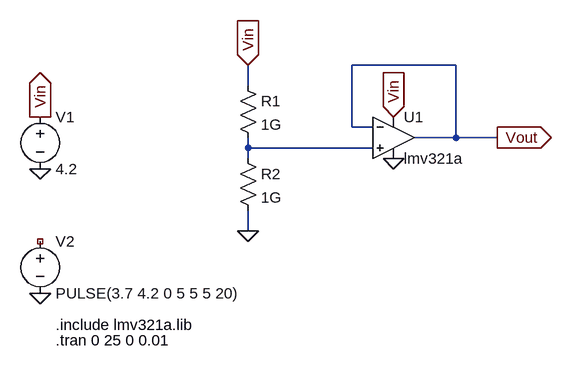
[diagram p0: schematic EEE3088F_ADC_buffer_test.asc]
EEE3088F_ADC_buffer_test.asc, the LTspice schematic file:
Version 4
SHEET 1 880 680
WIRE 496 32 336 32
WIRE 176 64 176 32
WIRE 336 128 336 32
WIRE 368 128 336 128
WIRE 496 144 496 32
WIRE 496 144 432 144
WIRE 560 144 496 144
WIRE 176 160 176 144
WIRE 368 160 176 160
WIRE 176 176 176 160
WIRE 176 288 176 256
FLAG -144 192 0
FLAG 400 176 0
FLAG -144 112 Vin
IOPIN -144 112 Out
FLAG -144 384 0
FLAG 176 32 Vin
IOPIN 176 32 In
FLAG 560 144 Vout
IOPIN 560 144 Out
FLAG 176 288 0
FLAG 400 112 Vin
IOPIN 400 112 In
SYMBOL OpAmps\\opamp2 400 80 R0
SYMATTR InstName U1
SYMATTR Value lmv321a
SYMBOL voltage -144 96 R0
WINDOW 123 0 0 Left 0
WINDOW 39 0 0 Left 0
SYMATTR InstName V1
SYMATTR Value 4.2
SYMBOL voltage -144 288 R0
WINDOW 123 0 0 Left 0
WINDOW 39 0 0 Left 0
SYMATTR InstName V2
SYMATTR Value PULSE(3.7 4.2 0 5 5 5 20)
SYMBOL res 160 48 R0
SYMATTR InstName R1
SYMATTR Value 1G
SYMBOL res 160 160 R0
SYMATTR InstName R2
SYMATTR Value 1G
TEXT -120 432 Left 2 !.include lmv321a.lib
TEXT -120 456 Left 2 !.tran 0 25 0 0.01

The netlist it stands for:
* EEE3088F_ADC_buffer_test.asc
XU1 N001 Vout Vin 0 Vout lmv321a  ; pins In+ In- V+ V- OUT
V1 Vin 0 4.2
V2 NC_01 0 PULSE(3.7 4.2 0 5 5 5 20)
R1 Vin N001 1G
R2 N001 0 1G
.include lmv321a.lib
.tran 0 25 0 0.01
.backanno
.end